# EAGLE design control-17 (EAGLE 9.0.1)
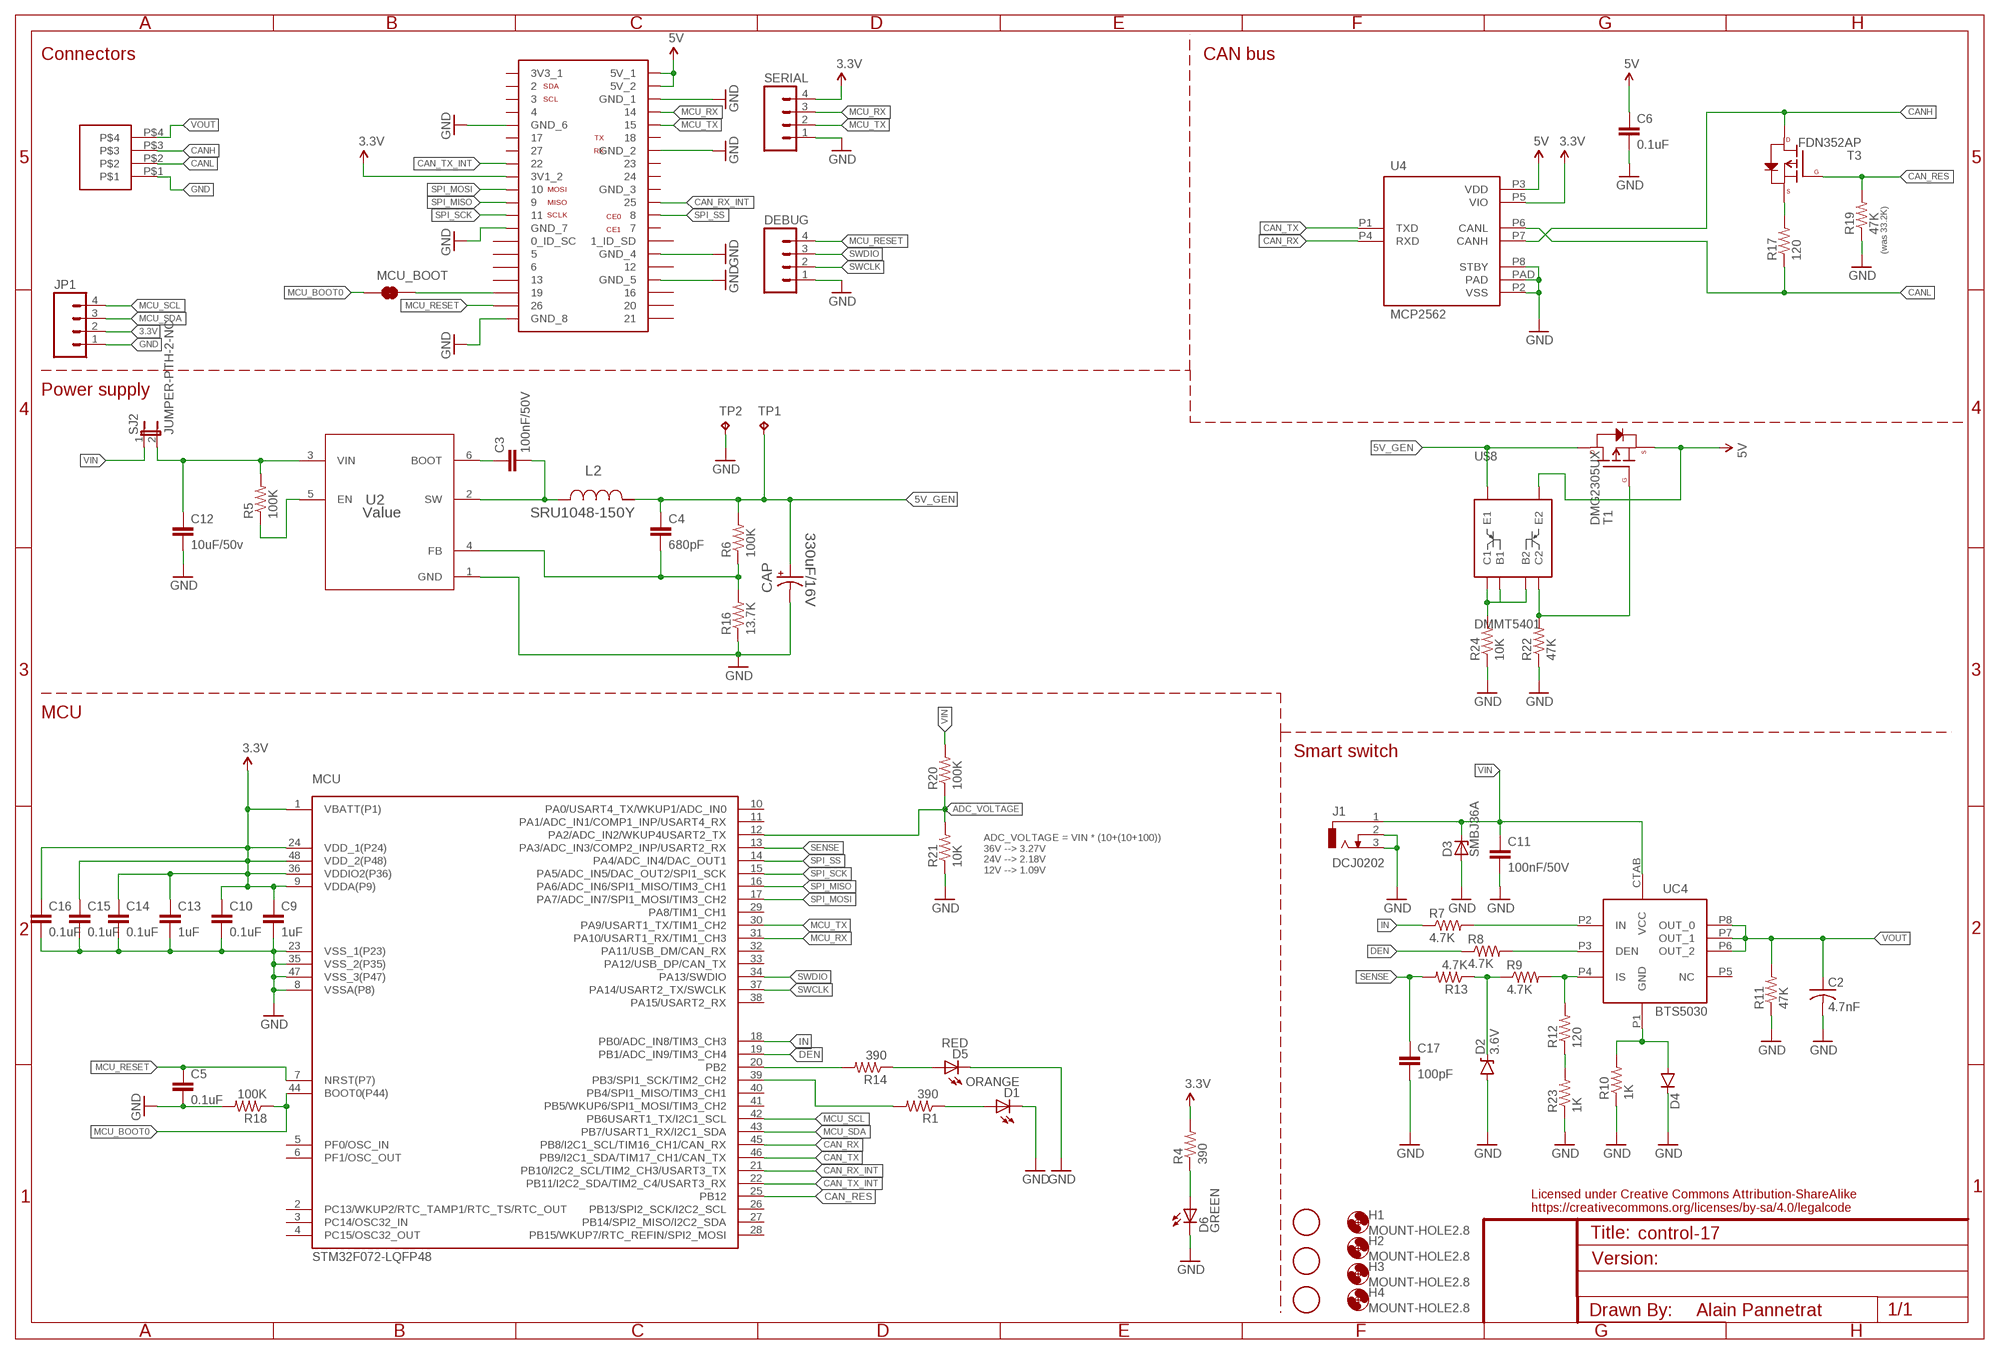
[diagram p0: schematic, sheet 1]

## Parts
C2  4.7nF  C-USC0805  [C0805]
C3  100nF/50V  CAP0805  [0805]
C4  680pF  CAP0603-CAP  [0603-CAP]
C5  0.1uF  CAP0603-CAP  [0603-CAP]
C6  0.1uF  CAP0603-CAP  [0603-CAP]
C9  1uF  CAP0805  [0805]
C10  0.1uF  CAP0603-CAP  [0603-CAP]
C11  100nF/50V  CAP0805  [0805]
C12  10uF/50v  CAP1206  [1206]
C13  1uF  CAP0805  [0805]
C14  0.1uF  CAP0603-CAP  [0603-CAP]
C15  0.1uF  CAP0603-CAP  [0603-CAP]
C16  0.1uF  CAP0603-CAP  [0603-CAP]
C17  100pF  CAP0805  [0805]
CAP  330uF/16V  CAP_POLE  [PANASONIC_E]
D1  ORANGE  LEDCHIPLED_0805  [CHIPLED_0805]
D2  3.6V  DIODE-ZENER3.3V  [SOD-323]
D3  SMBJ36A  ZENER-DIODESMB  [SMB]
D4  DIODESMA  [SMA-DIODE]
D5  RED  LEDCHIPLED_0805  [CHIPLED_0805]
D6  GREEN  LEDCHIPLED_0805  [CHIPLED_0805]
DEBUG  M04PTH  [1X04]
H1  MOUNT-HOLE2.8  [2,8]
H2  MOUNT-HOLE2.8  [2,8]
H3  MOUNT-HOLE2.8  [2,8]
H4  MOUNT-HOLE2.8  [2,8]
J1  DCJ0202  [DCJ0202]
JP1  M04JST  [1X04-1.5MM_JST]
L2  SRU1048-150Y  [SRU1048]
MCU  STM32F072-LQFP48  [LQFP48]
MCU_BOOT  JUMPER-PAD-2-NC_BY_TRACE  [PAD-JUMPER-2-NC_BY_TRACE_YES_SILK]
PI  RASPBERRY-PI-GPIO-SEPARATE  [2X20]
R1  390  R-US_R0603  [R0603]
R4  390  R-US_R0603  [R0603]
R5  100K  R-US_R0603  [R0603]
R6  100K  R-US_R0603  [R0603]
R7  4.7K  R-US_R0805  [R0805]
R8  4.7K  R-US_R0805  [R0805]
R9  4.7K  R-US_R0805  [R0805]
R10  1K  R-US_R0805  [R0805]
R11  47K  R-US_R0805  [R0805]
R12  120  R-US_R0805  [R0805]
R13  4.7K  R-US_R0805  [R0805]
R14  390  R-US_R0603  [R0603]
R16  13.7K  R-US_R0805  [R0805]
R17  120  R-US_R0805  [R0805]
R18  100K  R-US_R0603  [R0603]
R19  47K  R-US_R0805  [R0805]
R20  100K  R-US_R0603  [R0603]
R21  10K  R-US_R0805  [R0805]
R22  47K  R-US_R0805  [R0805]
R23  1K  R-US_R0805  [R0805]
R24  10K  R-US_R0805  [R0805]
SERIAL  M04PTH  [1X04]
SJ2  JUMPER-PTH-2-NC  [PTH-JUMPER-NC_BOTTOM_NO_SILK]
T1  DMG2305UX  P-CHANNEL-MOSFET  [SOT23-3]
T3  FDN352AP  P-CHANNEL-MOSFET  [SOT23-3]
TP1  TPPAD1-13  [P1-13]
TP2  TPPAD1-13  [P1-13]
U2  Value  TPS54202DDCR  [DDC0006A_N]
U4  MCP2562  [DFN3X3]
U$3  M04-PLUG-3.5  [M04-PLUG-3.5]
U$4  FIDUCIAL  [FIDUCIAL_1MM]
U$5  FIDUCIAL  [FIDUCIAL_1MM]
U$6  FIDUCIAL  [FIDUCIAL_1MM]
U$8  DMMT5401  [SOT-23-6]
UC4  BTS5030  [PG-DSO-8-43]

## Nets
3.3V: C9.1 C10.1 C13.1 C14.1 C15.1 C16.1 JP1.2 MCU.1(VBATT(P1)) MCU.9(VDDA(P9)) MCU.24(VDD_1(P24)) MCU.36(VDDIO2(P36)) MCU.48(VDD_2(P48)) PI.17(3V1_2) R4.2 SERIAL.4 U4.P5(VIO)
5V: C6.1 PI.2(5V_1) PI.4(5V_2) T1.2(S) U4.P3(VDD) U$8.5(E2)
5V_GEN: C4.1 CAP.+ L2.2 R6.2 T1.3(D) TP1.TP U$8.6(E1)
ADC_VOLTAGE: MCU.12(PA2/ADC_IN2/WKUP4USART2_TX) R20.1 R21.2
CAN_RES: MCU.25(PB12) R19.2 T3.1(G)
CAN_RX: MCU.45(PB8/I2C1_SCL/TIM16_CH1/CAN_RX) U4.P4(RXD)
CAN_RX_INT: MCU.21(PB10/I2C2_SCL/TIM2_CH3/USART3_TX) PI.22
CAN_TX: MCU.46(PB9/I2C1_SDA/TIM17_CH1/CAN_TX) U4.P1(TXD)
CAN_TX_INT: MCU.22(PB11/I2C2_SDA/TIM2_C4/USART3_RX) PI.15
CANH: T3.3(D) U4.P7(CANH) U$3.P$3
CANL: R17.1 U4.P6(CANL) U$3.P$2
DEN: MCU.19(PB1/ADC_IN9/TIM3_CH4) R8.1
GND: C2.2 C5.2 C6.2 C9.2 C10.2 C11.2 C12.2 C13.2 C14.2 C15.2 C16.2 C17.2 CAP.- D1.C D2.A D3.A D4.C D5.C D6.C DEBUG.1 J1.2 J1.3 JP1.1 MCU.8(VSSA(P8)) MCU.23(VSS_1(P23)) MCU.35(VSS_2(P35)) MCU.47(VSS_3(P47)) PI.6(GND_1) PI.9(GND_6) PI.14(GND_2) PI.25(GND_7) PI.30(GND_4) PI.34(GND_5) PI.39(GND_8) R10.1 R11.1 R16.1 R18.2 R19.1 R21.1 R22.1 R23.1 R24.1 SERIAL.1 TP2.TP U2.1(GND) U4.P2(VSS) U4.P8(STBY) U4.PAD U$3.P$1
IN: MCU.18(PB0/ADC_IN8/TIM3_CH3) R7.1
MCU_BOOT0: MCU.44(BOOT0(P44)) MCU_BOOT.1 R18.1
MCU_RESET: C5.1 DEBUG.4 MCU.7(NRST(P7)) PI.37
MCU_RX: MCU.31(PA10/USART1_RX/TIM1_CH3) PI.8 SERIAL.3
MCU_SCL: JP1.4 MCU.42(PB6USART1_TX/I2C1_SCL)
MCU_SDA: JP1.3 MCU.43(PB7/USART1_RX/I2C1_SDA)
MCU_TX: MCU.30(PA9/USART1_TX/TIM1_CH2) PI.10 SERIAL.2
N$1: D2.C R9.1 R13.1
N$2: D1.A R1.1
N$3: R7.2 UC4.P2(IN)
N$4: MCU_BOOT.2 PI.35
N$5: R5.1 U2.5(EN)
N$6: C12.1 R5.2 SJ2.2 U2.3(VIN)
N$7: C4.2 R6.1 R16.2 U2.4(FB)
N$8: R12.1 R23.2
N$10: R8.2 UC4.P3(DEN)
N$12: MCU.20(PB2) R14.2
N$13: R17.2 T3.2(S)
N$14: R9.2 R12.2 UC4.P4(IS)
N$15: D4.A R10.2 UC4.P1(GND)
N$16: MCU.39(PB3/SPI1_SCK/TIM2_CH2) R1.2
N$18: C3.2 L2.1 U2.2(SW)
N$19: D5.A R14.1
N$20: C3.1 U2.6(BOOT)
N$22: D6.A R4.1
N$26: R24.2 U$8.1(C1) U$8.2(B1) U$8.3(B2)
N$30: R22.2 T1.1(G) U$8.4(C2)
SENSE: C17.1 MCU.13(PA3/ADC_IN3/COMP2_INP/USART2_RX) R13.2
SPI_MISO: MCU.16(PA6/ADC_IN6/SPI1_MISO/TIM3_CH1) PI.21
SPI_MOSI: MCU.17(PA7/ADC_IN7/SPI1_MOSI/TIM3_CH2) PI.19
SPI_SCK: MCU.15(PA5/ADC_IN5/DAC_OUT2/SPI1_SCK) PI.23
SPI_SS: MCU.14(PA4/ADC_IN4/DAC_OUT1) PI.24
SWCLK: DEBUG.2 MCU.37(PA14/USART2_TX/SWCLK)
SWDIO: DEBUG.3 MCU.34(PA13/SWDIO)
VIN: C11.1 D3.C J1.1 R20.2 SJ2.1 UC4.CTAB(VCC)
VOUT: C2.1 R11.2 U$3.P$4 UC4.P6(OUT_2) UC4.P7(OUT_1) UC4.P8(OUT_0)
Unconnected: MCU.2(PC13/WKUP2/RTC_TAMP1/RTC_TS/RTC_OUT) MCU.3(PC14/OSC32_IN) MCU.4(PC15/OSC32_OUT) MCU.5(PF0/OSC_IN) MCU.6(PF1/OSC_OUT) MCU.10(PA0/USART4_TX/WKUP1/ADC_IN0) MCU.11(PA1/ADC_IN1/COMP1_INP/USART4_RX) MCU.26(PB13/SPI2_SCK/I2C2_SCL) MCU.27(PB14/SPI2_MISO/I2C2_SDA) MCU.28(PB15/WKUP7/RTC_REFIN/SPI2_MOSI) MCU.29(PA8/TIM1_CH1) MCU.32(PA11/USB_DM/CAN_RX) MCU.33(PA12/USB_DP/CAN_TX) MCU.38(PA15/USART2_RX) MCU.40(PB4/SPI1_MISO/TIM3_CH1) MCU.41(PB5/WKUP6/SPI1_MOSI/TIM3_CH2) PI.3 PI.5 PI.7 PI.11 PI.12 PI.13 PI.16 PI.18 PI.20(GND_3) PI.26 PI.27(0_ID_SC) PI.28(1_ID_SD) PI.29 PI.31 PI.32 PI.33 PI.36 PI.38 PI.40 UC4.P5(NC)

## Notes on the sheet
- Connectors | CAN bus
- (was 33.2K)
- Power supply
- MCU
- Smart switch
- ADC_VOLTAGE = VIN * (10+(10+100))
  36V --> 3.27V
  24V --> 2.18V
  12V --> 1.09V
- Licensed under Creative Commons Attribution-ShareAlike
  https://creativecommons.org/licenses/by-sa/4.0/legalcode
- Alain Pannetrat

## Power pins joined to a net without a drawn wire
3V3_1: PI.1(3V3_1)

## Library data of the parts
C2 = rcl:C-US: CAPACITOR, American symbol
C3 C5 C6 C9-C17 = SparkFun-Capacitors:CAP: Capacitor Standard 0603 ceramic capacitor, and 0.1" leaded capacitor.
C4 = SparkFun-Passives:CAP: Capacitor Standard 0603 ceramic capacitor, and 0.1" leaded capacitor.
CAP = SparkFun-Passives:CAP_POL: Capacitor Polarized These are standard SMD and PTH capacitors. Normally 10uF, 47uF, and 100uF in electrolytic and tantalum varieties. Always verify the external diameter of the through hole cap, it varies with capacity, voltage, and manufacturer. The EIA devices should be standard.
D1 D5 D6 = adafruit:LED: LED OSRAM: - CHIPLED LG R971, LG N971, LY N971, LG Q971, LY Q971, LO R971, LY R971 LH N974, LH R974 LS Q976, LO Q976, LY Q976 LO Q996 - Hyper CHIPLED LW Q18S LB Q993, LB Q99A, LB R99A - SideLED LS A670, LO A670, LY A670, LG A670, LP A670 LB A673, LV A673, LT A673, LW A673 LH A674 LY A675 LS A676, LA A676, LO A676, LY A676, LW A676 LS A679, LY A679, LG A679 - Hyper Micro SIDELED® LS Y876, LA Y876, LO Y876, LY Y876 LT Y87S - SmartLED LW L88C, LW L88S LB L89C, LB L89S, LG L890 LS L89K, LO L89K, LY L89K LS L896, LA L896, LO L896, LY L896 - TOPLED LS T670, LO T670, LY T670, LG T670, LP T670 LSG T670, LSP T670, LSY T670, LOP T670, LYG T670 LG T671, LOG T671, LSG T671 LB T673, LV T673, LT T673, LW T673 LH T674 LS T676, LA T676, LO T676, LY T676, LB T676, LH T676, LSB T676, LW T676 LB T67C, LV T67C, LT T67C, LS T67K, LO T67K, LY T67K, LW E67C LS E67B, LA E67B, LO E67B, LY E67B, LB E67C, LV E67C, LT E67C LW T67C LS T679, LY T679, LG T679 LS T770, LO T770, LY T770, LG T770, LP T770 LB T773, LV T773, LT T773, LW T773 LH T774 LS E675, LA E675, LY E675, LS T675 LS T776, LA T776, LO T776, LY T776, LB T776 LHGB T686 LT T68C, LB T68C - Hyper Mini TOPLED® LB M676 - Mini TOPLED Santana® LG M470 LS M47K, LO M47K, LY M47K Source: http://www.osram.convergy.de/
D2 = SparkFun-DiscreteSemi:DIODE-ZENER: Zener Diode Production Part - 8199 3.4V Zener Voltage; PROD_ID: DIO-11284; VALUE: 3.3V
D3 = diode:ZENER-DIODE: Z-Diode
D4 = SparkFun-DiscreteSemi:DIODE: Diode These are standard reverse protection diodes and small signal diodes. SMA package can handle up to about 1A. SOD-323 can handle about 200mA. What the SOD-323 package when ordering, there are some mfgs out there that are 5-pin packages.
DEBUG JP1 SERIAL = SparkFun-Connectors:M04: Header 4 Standard 4-pin 0.1" header. Use with straight break away headers (SKU : PRT-00116), right angle break away headers (PRT-00553), swiss pins (PRT-00743), machine pins (PRT-00117), and female headers (PRT-00115). Molex polarized connector foot print use with SKU : PRT-08231 with associated crimp pins and housings. 1MM SMD Version SKU: PRT-10208
H1-H4 = holes:MOUNT-HOLE: MOUNTING HOLE with drill center marker
J1 = con-jack:DCJ0202: DC POWER JACK Source: DCJ0202.pdf; OC_FARNELL: unknown; OC_NEWARK: unknown
L2 = AlainElements:SRU1048-150Y; DCR: 0.029; IDC: 3.2; L: 1.5E5; MANUFACTURER_NAME: Bourns; MANUFACTURER_PART_NUMBER: SRU1048150Y; VENDOR: Bourns
MCU = stm32f0:STM32F072
MCU_BOOT = SparkFun-Passives:JUMPER-PAD-2-NC_BY_TRACE
PI = pimoroni-headers:RASPBERRY-PI-GPIO-SEPARATE
R1 R4 R11 R14 R16 R18 R19 = adafruit:R-US_: RESISTOR, American symbol
R5-R10 R12 R13 R17 R20-R24 = resistor:R-US_: RESISTOR, American symbol
SJ2 = SparkFun-Passives:JUMPER-PTH-2-NC
T1 T3 = GeekAmmo:P-CHANNEL-MOSFET: P-Channel MOSFET Mode Field Effect Transistor
TP1 TP2 = testpad:TP: Test pad
U2 = AlainElements:TPS54202DDCR; ALTERNATEPARTNUMBER: TPS54202DDCT; APPLICATION_BUILDNUMBER: *; COMPTYPE: IC; MANUFACTURER: Texas Instruments; MANUFACTURER_NAME: Texas Instruments; MANUFACTURER_PART_NUMBER: TPS54202DDCR; MOUNTTYPE: SMT; PACKAGEREFERENCE: DDC0006A; PARTNUMBER: TPS54202DDCR; PIN_COUNT: 6; REFDES: RefDes; ROHS: Y; TYPE: TYPE
U4 = can:MCP2562
U$3 = AlainConnector:M04-PLUG-3.5
U$4-U$6 = adafruit:FIDUCIAL: For use by pick and place machines to calibrate the vision/machine, 1mm By microbuilder.eu
U$8 = pimoroni-ics:DMMT5401
UC4 = BTS5030:BTS5030

## Board
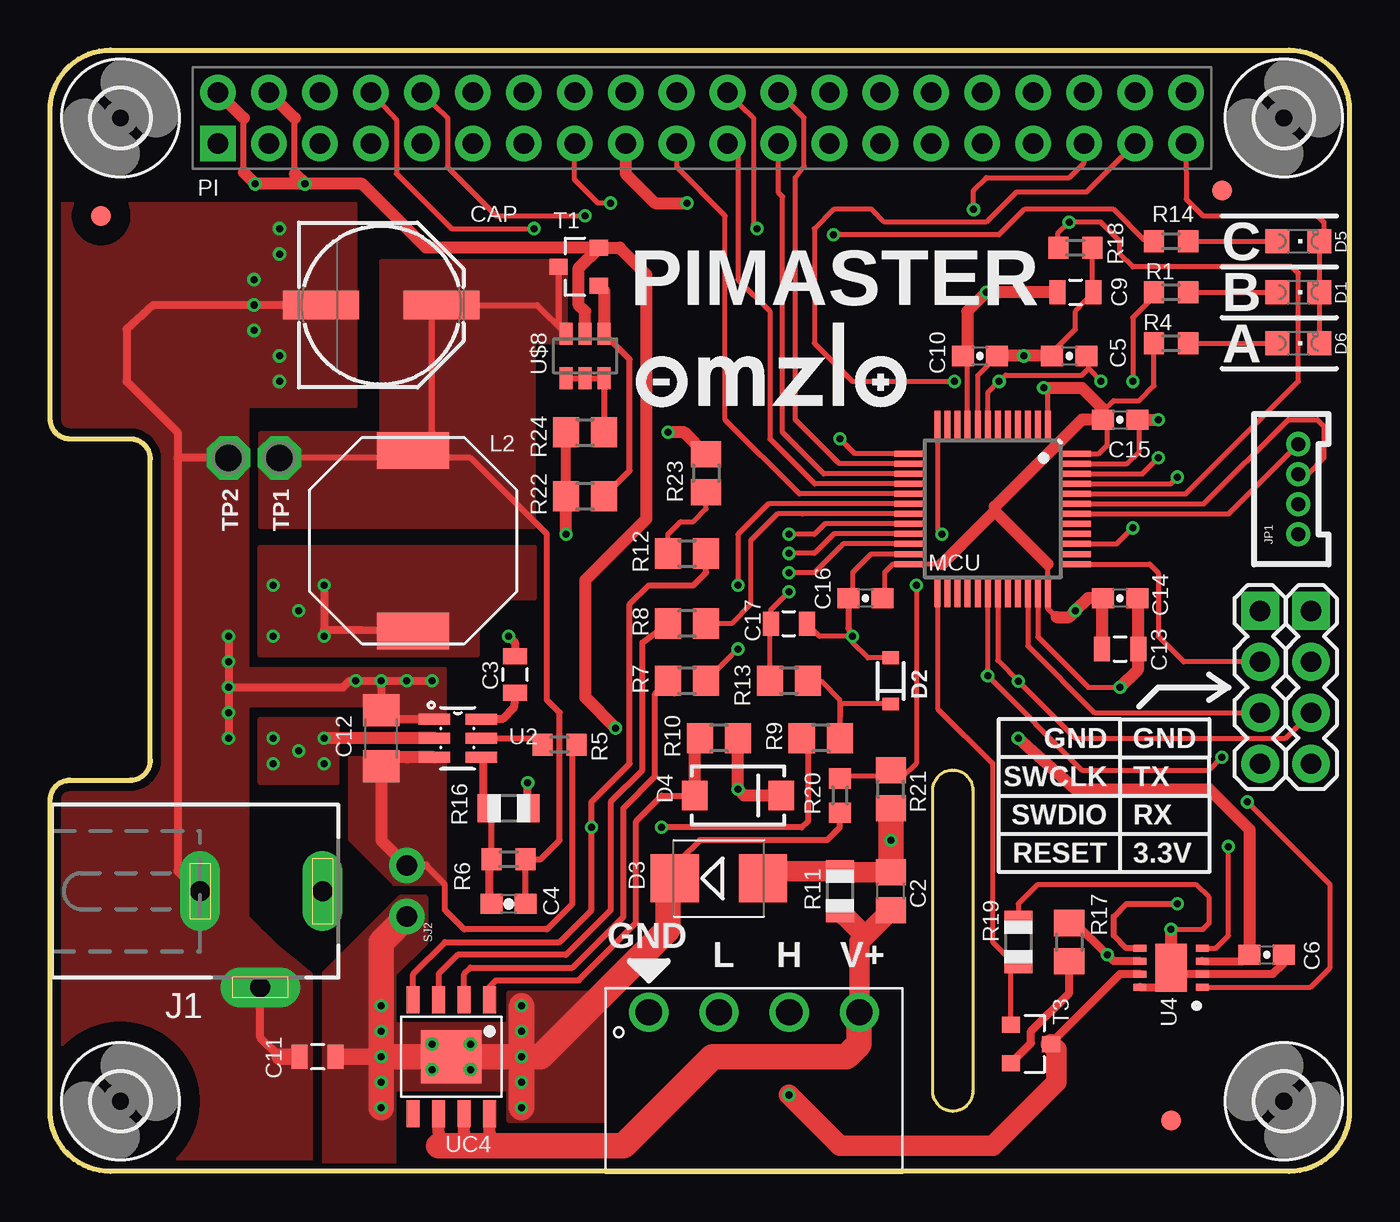
[diagram p1: board, top side]
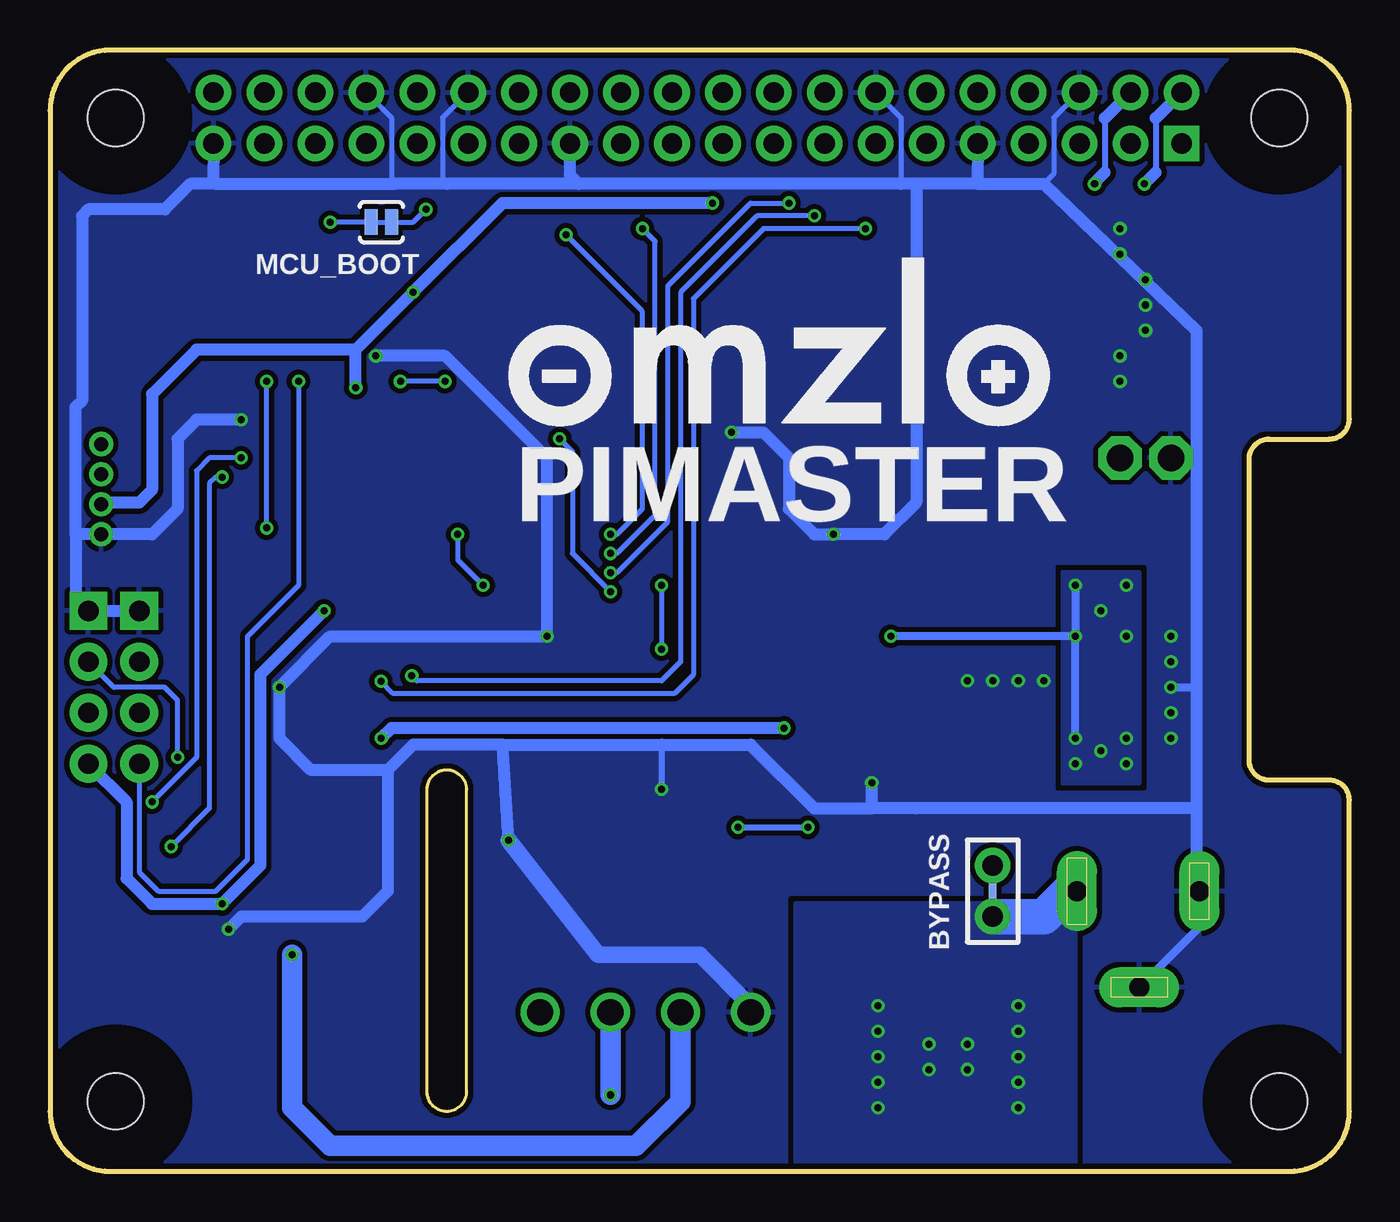
[diagram p2: board, bottom side, seen from below]

Size 64.77 x 55.88 mm. Coordinates in mm from the lower left corner, seen from the top.
Outline: 3,0 arc-90 0,3 0,18.5 arc-90 1,19.5 4,19.5 arc90 5,20.5 5,35.5 arc90 4,36.5 1,36.5 arc-90 0,37.5 0,52.88 arc-90 3,55.88 61.77,55.88 arc-90 64.77,52.88 64.77,3 arc-90 61.77,0 3,0
Outline: 44,4 44,19 arc-90 45,20 arc-90 46,19 46,4 arc-90 45,3 arc-90 44,4
Copper layers (1*16): Top 0.035mm / dielectric 1.5mm / Bottom 0.035mm
Design rules "SeeedStudio_2layer_DRU_no_angle_20140221": minimum track width 6mil, minimum drill 12mil, track to track 6mil, track to pad 6mil, pad to pad 6mil, via to via 6mil, smd to smd 0mil, copper to edge 10mil, drill to drill 10mil, minimum pad ring 10mil, minimum via ring 6mil, stop-mask expansion 2mil, vias tented up to drill 100mil, thermal gap 10mil

### Footprints (pad centres in the part's own frame; a part is rotated, then mirrored left to right if it is on the bottom)
C0805 = smd 1.3 x 1.5: 1 -0.95,0; 2 0.95,0
0805 = smd 0.8 x 1.2: 1 -0.9,0; 2 0.9,0
0603-CAP = smd 1.1 x 1: 1 -0.85,0; 2 0.85,0
1206 = smd 1.6 x 1.8: 1 -1.4,0; 2 1.4,0
PANASONIC_E = smd 3.8 x 1.4: + 3,0; - -3,0
CHIPLED_0805 = smd 1.2 x 1.2: A 0,-1.05; C 0,1.05
SOD-323 = smd 0.63 x 0.83: A 1.15,0; C -1.15,0
SMB = smd 2.4 x 2.4: A 2.2,0; C -2.2,0
SMA-DIODE = smd 1.27 x 1.47: A -2.15,0; C 2.15,0
1X04 = drill 1.016 pad 1.88 square: 1 0,0 | drill 1.016 pad 1.88: 2 2.54,0; 3 5.08,0; 4 7.62,0
2,8 = hole 2.8: 0,0
DCJ0202 = drill 1 pad 2 long: 1 0,3.1; 2 4.8,0; 3 0,-3
1X04-1.5MM_JST = drill 0.7: 1 0,0; 2 1.5,0; 3 3,0; 4 4.5,0
SRU1048 = smd 1.803 x 3.607: 1 -4.496,0; 2 4.496,0
LQFP48 = smd 1.5 x 0.3: 1 -4.15,2.75; 2 -4.15,2.25; 3 -4.15,1.75; 4 -4.15,1.25; 5 -4.15,0.75; 6 -4.15,0.25; 7 -4.15,-0.25; 8 -4.15,-0.75; 9 -4.15,-1.25; 10 -4.15,-1.75; 11 -4.15,-2.25; 12 -4.15,-2.75; 25 4.15,-2.75; 26 4.15,-2.25; 27 4.15,-1.75; 28 4.15,-1.25; 29 4.15,-0.75; 30 4.15,-0.25; 31 4.15,0.25; 32 4.15,0.75; 33 4.15,1.25; 34 4.15,1.75; 35 4.15,2.25; 36 4.15,2.75 | smd 0.3 x 1.5: 13 -2.75,-4.15; 14 -2.25,-4.15; 15 -1.75,-4.15; 16 -1.25,-4.15; 17 -0.75,-4.15; 18 -0.25,-4.15; 19 0.25,-4.15; 20 0.75,-4.15; 21 1.25,-4.15; 22 1.75,-4.15; 23 2.25,-4.15; 24 2.75,-4.15; 37 2.75,4.15; 38 2.25,4.15; 39 1.75,4.15; 40 1.25,4.15; 41 0.75,4.15; 42 0.25,4.15; 43 -0.25,4.15; 44 -0.75,4.15; 45 -1.25,4.15; 46 -1.75,4.15; 47 -2.25,4.15; 48 -2.75,4.15
PAD-JUMPER-2-NC_BY_TRACE_YES_SILK = smd 0.635 x 1.27: 1 -0.508,0; 2 0.508,0
2X20 = drill 1.016 pad 1.778 square: 1 -24.13,-1.27 | drill 1.016 pad 1.778: 2 -24.13,1.27; 3 -21.59,-1.27; 4 -21.59,1.27; 5 -19.05,-1.27; 6 -19.05,1.27; 7 -16.51,-1.27; 8 -16.51,1.27; 9 -13.97,-1.27; 10 -13.97,1.27; 11 -11.43,-1.27; 12 -11.43,1.27; 13 -8.89,-1.27; 14 -8.89,1.27; 15 -6.35,-1.27; 16 -6.35,1.27; 17 -3.81,-1.27; 18 -3.81,1.27; 19 -1.27,-1.27; 20 -1.27,1.27; 21 1.27,-1.27; 22 1.27,1.27; 23 3.81,-1.27; 24 3.81,1.27; 25 6.35,-1.27; 26 6.35,1.27; 27 8.89,-1.27; 28 8.89,1.27; 29 11.43,-1.27; 30 11.43,1.27; 31 13.97,-1.27; 32 13.97,1.27; 33 16.51,-1.27; 34 16.51,1.27; 35 19.05,-1.27; 36 19.05,1.27; 37 21.59,-1.27; 38 21.59,1.27; 39 24.13,-1.27; 40 24.13,1.27
R0603 = smd 1 x 1.1: 1 -0.85,0; 2 0.85,0
R0805 = smd 1.3 x 1.5: 1 -0.95,0; 2 0.95,0
R0805' = smd 1.1 x 1.4: 1 -1,0; 2 1,0
PTH-JUMPER-NC_BOTTOM_NO_SILK = drill 1.016 pad 1.778: 1 -1.27,0; 2 1.27,0 | smd 1.27 x 0.381 bottom: P$1 0,0
SOT23-3 = smd 0.8 x 0.9: 1 -0.95,-1; 2 0.95,-1; 3 0,1
P1-13 = drill 1.321 pad 2.159 octagon: TP 0,0
DDC0006A_N = smd 1.575 x 0.559: 1 -1.168,0.95; 2 -1.168,0; 3 -1.168,-0.95; 4 1.168,-0.95; 5 1.168,0; 6 1.168,0.95
DFN3X3 = smd 0.35 x 0.65: P1 -0.975,-1.55; P2 -0.325,-1.55; P3 0.325,-1.55; P4 0.975,-1.55; P5 0.975,1.55; P6 0.325,1.55; P7 -0.325,1.55; P8 -0.975,1.55 | smd 2.4 x 1.55: PAD 0,0
M04-PLUG-3.5 = drill 1.3: P$1 0,0; P$2 3.5,0; P$3 7,0; P$4 10.5,0
FIDUCIAL_1MM = smd 1 x 1: 1 0,0
SOT-23-6 = smd 0.65 x 1.1: 1 0.95,1.1; 2 0,1.1; 3 -0.95,1.1; 4 -0.95,-1.1; 5 0,-1.1; 6 0.95,-1.1
PG-DSO-8-43 = smd 2.65 x 3: CTAB 0,0 | smd 1.35 x 0.65: P1 -2.845,1.905; P2 -2.845,0.635; P3 -2.845,-0.635; P4 -2.845,-1.905; P5 2.845,-1.905; P6 2.845,-0.635; P7 2.845,0.635; P8 2.845,1.905

### Placement (x,y rotation side)
C2  41.91,13.97 90 top
C3  23.18,24.77 90 top
C4  22.86,13.34 180 top
C5  50.8,40.64 180 top
C6  60.64,10.79 0 top
C9  51.12,43.81 0 top
C10  46.35,40.64 0 top
C11  13.34,5.71 180 top
C12  16.51,21.59 90 top
C13  53.34,26.04 0 top
C14  53.34,28.57 0 top
C15  53.34,37.47 0 top
C16  40.64,28.57 180 top
C17  36.83,27.3 0 top
CAP  16.51,43.18 0 top
D1  62.23,43.81 270 top
D2  41.91,24.45 90 top
D3  33.34,14.61 0 top
D4  34.29,18.73 0 top
D5  62.23,46.35 270 top
D6  62.23,41.27 270 top
DEBUG  60.33,27.94 270 top
H1  3.5,3.5 0 top
H2  3.5,52.5 0 top
H3  61.5,3.5 90 top
H4  61.5,52.5 0 top
J1  10.48,13.97 270 top
JP1  62.23,31.75 90 top
L2  18.1,31.43 90 top
MCU  46.99,33.02 270 top
MCU_BOOT  48.26,47.31 0 bottom
PI  32.5,52.5 0 top
R1  55.88,43.81 180 top
R4  55.88,41.27 180 top
R5  25.4,21.27 0 top
R6  22.86,15.56 0 top
R7  31.75,24.45 180 top
R8  31.75,27.3 180 top
R9  38.42,21.59 180 top
R10  33.34,21.59 180 top
R11  47K  [R0805']  39.37,13.97 270 top
R12  31.75,30.8 0 top
R13  36.83,24.45 180 top
R14  55.88,46.35 180 top
R16  13.7K  [R0805']  22.86,18.1 180 top
R17  50.8,11.43 270 top
R18  51.12,46.04 0 top
R19  47K  [R0805']  48.26,11.43 270 top
R20  39.37,18.73 270 top
R21  41.91,19.05 90 top
R22  26.67,33.66 0 top
R23  32.7,34.8 270 top
R24  26.67,36.83 0 top
SERIAL  62.87,27.94 270 top
SJ2  17.78,13.97 90 top
T1  26.35,45.09 90 top
T3  48.9,6.35 270 top
TP1  11.43,35.56 90 top
TP2  8.89,35.56 0 top
U2  20.32,21.59 0 top
U4  55.88,10.16 90 top
U$1  [OMZLO-0.5]  29.21,38.1 0 top
U$2  [OMZLO]  41.91,37.15 0 bottom
U$3  29.84,7.94 0 top
U$4  58.42,48.9 0 top
U$5  2.54,47.62 0 top
U$6  55.88,2.54 0 top
U$8  26.67,40.64 180 top
UC4  20,5.71 270 top

### Tracks (layer width: path | path; a pad name or v marks a point on that pad's centre or on a via)
3.3V  (via drill 0.35)
  Top 0.254: C16.1 41.59,28.68 41.59,29.84 42.02,30.27 MCU.24 44.45,30.27 | 50.16,27.62 49.74,28.05 MCU.36 49.74,30.27 | MCU.9 45.74,40.41 45.61,40.53 | 45.61,40.53 C10.1 45.4,40.74 | MCU.48 52.28,35.77 52.7,36.2 52.7,37.25 C15.1 | 52.44,28.52 C14.1 | 45.72,40.64 45.61,40.53 | 52.49,37.88 53.02,38.42 54.29,38.42 55.03,39.16 R4.2 | MCU.1 49.74,38.84 v49.53,39.05
  Top 0.305: U4.P5 53.63,11.13 53.02,11.75 53.02,12.7 53.66,13.34 v56.2,13.34
  Top 0.61: C14.1 51.75,28.57 v51.12,27.94 50.8,27.62 50.16,27.62 | 52.44,28.52 C13.1 | C9.1 v46.67,43.81 45.72,42.86 45.72,40.64 | PI.17 28.69,49.73 30.16,48.26 v31.75,48.26 | 41.7,28.57 41.59,28.68 | 47.1,32.91 44.45,30.27 | 49.74,30.27 47.1,32.91 | v49.53,39.05 51.44,39.05 52.39,38.1 52.39,37.57 C15.1 | 52.49,37.88 C15.1 | C15.1 51.44,37.47 47.1,33.13 47.1,32.91
  Bottom 0.254: 62.14,33.34 JP1.2
  Bottom 0.61: SERIAL.4 60.96,18.41 60.96,14.61 59.69,13.34 v56.2,13.34 54.29,15.24 54.29,24.77 v51.12,27.94 | v31.75,48.26 42.23,48.26 v46.67,43.81 49.53,40.96 | 49.53,40.96 57.47,40.96 59.69,38.73 59.69,33.97 60.33,33.34 62.14,33.34 | v49.53,39.05 49.53,40.96
5V  (via drill 0.35)
  Top 0.254: 59.48,10.48 C6.1
  Top 0.305: 12.19,49.72 12.19,52.49 | 9.65,49.78 9.65,52.49
  Top 0.406: U4.P3 59.48,10.48
  Top 0.61: U$8.5 26.67,42.86 26.35,43.18 26.35,45.03 T1.2 | T1.2 18.73,46.03 15.56,49.21 v12.7,49.21 | 12.19,52.49 PI.4 | v12.7,49.21 12.19,49.72 | v12.7,49.21 v10.22,49.21 9.65,49.78 | 9.65,52.49 PI.2 | T1.2 28.39,46.03 29.72,44.7 29.72,32.51 26.67,29.46 26.67,23.62 v28.19,22.1 | v48.26,21.59 51.12,19.05 57.78,19.05 59.79,17.04 C6.1
  Bottom 0.305: 9.65,52.49 9.65,49.78 | 12.19,52.49 12.19,49.78 | 12.7,49.28 v12.7,49.21
  Bottom 0.61: v28.19,22.1 47.75,22.1 v48.26,21.59 | PI.2 9.65,52.49 | 9.65,49.78 v10.22,49.21 | PI.4 12.19,52.49 | 12.19,49.78 12.7,49.28
5V_GEN
  Top 0.305: 17.73,35.56 L2.2 19.05,36.88 19.05,43.18 | 17.73,35.56 TP1.TP | C4.1 R6.2 24.45,15.56 25.4,16.51 25.4,22.86 24.77,23.5 24.77,31.75 20.95,35.56 17.73,35.56 | CAP.+ 24.28,43.18 U$8.6 25.72,41.91 25.35,42.27 T1.3
  Top 0.406: C4.1 23.81,13.02 | 19.05,43.18 CAP.+
  Top 0.508: 23.81,13.34 C4.1
  pour Top (no thermals): 10.48,32.07 10.48,36.83 16.51,36.83 16.51,45.4 25.72,45.4 25.72,41.27 24.13,41.27 24.13,32.07
ADC_VOLTAGE  (via drill 0.35)
  Top 0.254: R20.1 39.37,19.68 41.59,19.68 R21.2 42.23,19.68 42.55,19.68 43.18,20.32 v43.18,29.21 | MCU.12 44.24,31.96 v44.45,31.75
  Bottom 0.254: v44.45,31.75 44.45,30.48 v43.18,29.21
CAN_RES
  Top 0.254: MCU.25 44.24,23.07 46.99,20.32 46.99,14.61 46.99,11.43 47.89,10.53 R19.2 47.9,10.16 T3.1
CAN_RX  (via drill 0.35)
  Top 0.254: MCU.45 55.86,34.27 v56.2,34.61 | U4.P4 58.12,11.13 58.74,11.75 v58.74,16.19
  Bottom 0.254: v56.2,34.61 56.52,34.61 56.83,34.29 56.83,18.1 v58.74,16.19
CAN_RX_INT  (via drill 0.35)
  Top 0.254: MCU.21 39.07,31.77 38.1,30.8 v36.83,30.8 | PI.22 35.05,52.51 35.05,47.18 v35.24,46.99
  Bottom 0.254: v36.83,30.8 36.51,30.8 34.61,32.7 34.61,46.35 v35.24,46.99
CAN_TX  (via drill 0.35)
  Top 0.254: MCU.46 54.45,34.77 v55.24,35.56 | v59.69,18.41 63.82,14.29 63.82,10.16 62.84,9.19 U4.P1
  Bottom 0.254: v55.24,35.56 56.83,35.56 57.47,34.92 57.47,20.64 v59.69,18.41
CAN_TX_INT  (via drill 0.35)
  Top 0.254: MCU.22 39.53,31.27 39.37,31.11 38.1,29.84 v36.83,29.84 | v27.94,48.26 27.69,48.26 27.3,48.26 26.15,49.41 PI.15
  Bottom 0.254: v36.83,29.84 36.51,29.84 33.97,32.38 33.97,44.13 29.84,48.26 v27.94,48.26
CANH  (via drill 0.35)
  Top 0.406: U4.P7 53.33,9.84 49.9,6.4 T3.3
  Top 0.61: 41.91,1.27 40.66,1.27
  Top 1.016: v36.83,3.81 39.37,1.27 41.91,1.27 46.99,1.27 49.53,3.81 49.9,4.17 50.16,4.45 50.16,6.08 T3.3
  Bottom 0.61: U$3.P$3 36.83,7.92
  Bottom 1.016: 36.83,7.92 v36.83,3.81
CANL  (via drill 0.35)
  Top 0.254: U4.P6
  Top 0.406: U4.P6 53.02,10.48 v52.7,10.79 51.12,12.38 R17.1
  Bottom 1.016: U$3.P$2 33.34,3.48 35.56,1.27 50.8,1.27 52.7,3.17 v52.7,10.79
DEN
  Top 0.254: MCU.19 37.53,32.77 36.26,32.77 34.92,31.43 34.92,28.26 33.97,27.3 R8.1
GND  (via drill 0.35)
  Top 0.254: 54.24,28.52 C14.2 | MCU.23 40.93,30.77 40.01,29.84 40.01,28.79 C16.2 | MCU.8 46.24,39.67 C10.2 | MCU.47 53.69,35.27 54.29,35.88 54.29,37.36 C15.2 | C5.2 49.95,40.8 51.12,41.96 51.12,42.86 C9.2 | 52.07,43.87 C9.2 | D2.A 40.76,25.6 40.01,26.35 v40.01,26.67 38.37,26.67 C17.2 | PI.39 56.64,48.45 57.47,47.62 63.18,47.62 63.5,47.31 63.5,46.58 D5.C D1.C D6.C | C9.2 52.07,43.81 51.97,43.92 R18.2 | C6.2 61.49,10.38 | U4.P2 | 56.2,9.84 U4.PAD 55.88,9.21 55.86,9.19 | MCU.35 49.24,26.64 51.75,24.13 v53.34,24.13 | v55.88,12.06 57.47,12.06 57.78,12.38 57.78,13.65 57.15,14.29 49.21,14.29 48.26,13.34 R19.1 | v25.72,31.75
  Top 0.305: C16.2 39.79,27.09 v40.01,26.67
  Top 0.406: v23.81,19.37 23.81,18.73 R16.1 | CAP.- 5.14,43.18 3.81,41.97 3.81,39.37 6.35,36.83 6.35,35.56 | 6.35,35.56 6.35,14.97 7.35,13.97 J1.3 | 61.49,10.38 60.96,9.84 U4.P2 | U4.P2 56.2,9.84 | U4.P8 55.86,9.19 | 11.43,5.71 10.48,6.67 J1.2 | v16.51,24.45 v15.24,24.45 14.92,24.45 14.61,24.13 v8.89,24.13 | v16.51,24.45 C12.2 16.96,22.54 U2.1 | v16.51,24.45 v17.78,24.45 v19.05,24.45 | TP2.TP 6.35,35.56 | v8.89,26.67 v8.89,25.4 v8.89,24.13 | v8.89,24.13 v8.89,22.86 v8.89,21.59
  Top 0.508: R22.1 R24.1
  Top 0.61: 54.24,28.52 C13.2 54.24,25.03 v53.34,24.13 | D4.C 34.61,18.73 v34.29,19.05 R10.1 | C5.2 v48.53,40.64 C10.2 | v55.88,12.06 U4.PAD | v25.72,31.75 R22.1 | R23.1 31.62,36.83 v30.8,36.83 | C15.2 v55.24,37.47
  Top 0.813: C11.2 11.43,5.71 | 39.42,14.92 R11.1 | 36.85,14.97 D3.A
  Top 1.016: C2.2 39.42,14.92 | R11.1 36.85,14.97
  Top 1.27: C2.2 v41.91,16.51 R21.1
  Bottom 0.254: PI.34 47.75,52.51 47.75,49.25 47.59,49.21 | PI.30 45.21,52.51 45.21,49.32 44.98,49.21 | 56.64,49.24 56.49,49.21 | PI.14 22.35,52.51 22.35,49.35 22.36,49.21 | PI.6 14.73,52.51 14.73,49.72 15.24,49.21 | 18.54,49.31 18.51,49.21
  Bottom 0.305: U$3.P$1 29.84,8.26 | 34.29,21.27 v34.29,19.05
  Bottom 0.406: v48.53,40.64 48.58,40.6 | J1.2 7.48,12.17 J1.3 | v8.89,24.13 7.62,24.13
  Bottom 0.61: v41.91,16.51 42.23,21.27 | 42.23,21.27 46.67,21.27 47.94,20 | 7.62,18.1 7.62,24.13 7.62,41.91 15.24,49.21 18.51,49.21 21.59,49.21 | 7.62,18.1 7.62,14.24 | 21.59,49.21 22.36,49.21 38.42,49.21 | 38.42,49.21 44.98,49.21 47.59,49.21 56.49,49.21 57.78,49.21 59.05,47.94 62.87,47.94 63.18,47.62 63.18,38.42 63.5,38.1 63.5,31.75 | 63.5,31.75 63.5,28.57 SERIAL.1 DEBUG.1 | 7.62,18.1 21.59,18.1 23.81,18.1 | 63.5,31.75 63.49,31.75 JP1.1 59.69,31.75 58.42,33.02 58.42,36.51 57.47,37.47 v55.24,37.47 | 38.42,49.21 38.86,49.66 PI.25 | PI.39 56.64,49.24 | PI.9 18.54,49.31 | 23.81,18.1 26.67,18.1 29.84,21.27 34.29,21.27 42.23,21.27 | 23.81,18.1 v23.81,19.37 | 47.94,20 51.75,20 53.34,21.59 v53.34,24.13 50.8,26.67 v40.01,26.67 40.01,35.56 45.09,40.64 v48.53,40.64 | 47.94,20 47.94,13.97 49.21,12.7 55.24,12.7 v55.88,12.06 | 21.59,49.21 21.59,33.34 23.18,31.75 v25.72,31.75 26.67,31.75 27.94,33.02 27.94,35.56 29.21,36.83 v30.8,36.83
  Bottom 0.813: 29.84,8.26 32.38,10.79 37.47,10.79 v41.91,16.51
  other vias: 11.43,46.99 11.43,45.72 10.16,44.45 10.16,43.18 10.16,41.91 11.43,40.64 11.43,39.37
  pour Top (isolate 0.406, rank 3, no thermals): 15.24,48.26 15.24,38.1 9.84,38.1 9.84,25.08 19.68,25.08 19.68,22.23 15.88,22.23 15.88,23.18 9.84,23.18 9.84,12.7 11.43,11.11 13.02,9.84 13.02,0 0,0 0,48.26
  pour Bottom (isolate 0.254, rank 3): 0,55.88 0,0 65.09,0 65.09,55.88
IN  (via drill 0.35)
  Top 0.254: MCU.18 35.81,33.27 34.29,31.75 v34.29,29.21 | v34.29,26.04 33.97,25.72 R7.1
  Bottom 0.254: v34.29,29.21 v34.29,26.04
MCU_BOOT0  (via drill 0.35)
  Top 0.254: MCU.44 56.63,33.77 62.23,39.37 62.23,44.77 61.91,45.09 53.98,45.09 53.34,45.72 53.34,46.35 52.39,47.31 v50.8,47.31 50.22,46.73 R18.1
  Bottom 0.254: MCU_BOOT.1 v50.8,47.31
MCU_RESET  (via drill 0.35)
  Top 0.254: MCU.7 46.74,38.8 v47.31,39.37 47.62,39.69 51.44,39.69 51.75,40.01 51.75,40.02 | C5.1 51.75,40.54 51.75,40.02 | 51.75,40.02 v52.39,39.38 | PI.37 51.67,48.81 48.17,48.81 46.67,47.31 41.59,47.31 40.96,47.94 39.05,47.94 38.1,46.99 38.1,41.27 40.01,39.37 v45.09,39.37
  Bottom 0.254: DEBUG.4 60.33,14.92 59.37,13.97 56.52,13.97 54.93,15.56 54.93,26.67 52.39,29.21 v52.39,39.38 | v45.09,39.37 v47.31,39.37
MCU_RX  (via drill 0.35)
  Top 0.254: SERIAL.3 61.59,21.59 51.12,21.59 v48.28,24.43 47.24,25.47 MCU.31 | PI.8 17.27,52.39 17.27,49.72 20,46.99 v24.13,46.99
  Bottom 0.254: v48.28,24.43 47.66,23.81 33.66,23.81 32.7,24.77 32.7,43.5 29.21,46.99 v24.13,46.99
MCU_SCL
  Top 0.254: MCU.42 58.75,32.77 JP1.4
MCU_SDA
  Top 0.254: MCU.43 57.53,33.27 61.72,37.47 63.18,37.47 63.5,37.15 63.5,35.56 62.69,34.75 JP1.3
MCU_TX  (via drill 0.35)
  Top 0.254: MCU.30 v46.74,24.7 51.44,20 57.78,20 v58.42,20.64 | PI.10 19.81,52.51 19.81,50.04 22.23,47.62 v26.67,47.62
  Bottom 0.254: v58.42,20.64 58.42,23.5 59.05,24.13 61.59,24.13 SERIAL.2 | v26.67,47.62 29.53,47.62 33.34,43.81 33.34,25.4 34.29,24.45 46.49,24.45 v46.74,24.7
N$1
  Top 0.254: R13.1 38.42,24.45 39.37,23.5 39.37,22 | 39.37,22 R9.1 | D2.C 39.4,23.3 39.37,22
N$2
  Top 0.254: R1.1 D1.A
N$3
  Top 0.305: 31.11,23.81 R7.2 30.16,23.81 30.16,19.68 28.57,18.1 28.57,12.7 26.04,10.16 20.95,10.16 20.64,9.84 UC4.P2
N$4  (via drill 0.35)
  Top 0.254: PI.35 51.55,50.28 50.8,49.53 46.67,49.53 46.04,48.9 v46.04,47.94
  Bottom 0.254: MCU_BOOT.2 46.67,47.31 v46.04,47.94
N$5
  Top 0.305: U2.5 24.45,21.59 24.55,21.49 R5.1
N$6
  Top 0.305: 18.73,15.24 19.68,14.29 19.68,13.02 20.64,12.06 24.77,12.06 26.04,13.34 26.04,21.06 R5.2
  Top 0.406: 18.73,15.24 SJ2.2
  Top 0.61: U2.3 17.78,20.64 16.51,20.64 16.51,16.51 SJ2.2
  pour Top (no thermals): 14.92,20.64 19.68,20.64 19.68,14.29 17.14,14.29 14.92,16.51
N$7
  Top 0.305: R6.1 22.01,17.95 R16.2
  Top 0.406: U2.4 21.59,20.64 21.59,20 21.59,18.41 R16.2 | 22.23,13.34 C4.2 21.91,13.34 21.91,15.56 R6.1
  Top 0.61: 21.86,15.61 21.91,15.56
N$8
  Top 0.254: R12.1 30.8,31.75 31.43,32.38 32.07,32.38 32.7,33.02 R23.2 32.7,33.97
N$10
  Top 0.305: R8.2 29.53,26.35 29.53,20 27.94,18.41 27.94,13.02 25.72,10.79 20.32,10.79 19.37,9.84 UC4.P3
N$12  (via drill 0.35)
  Top 0.254: MCU.20 38.62,32.27 38.1,31.75 v36.83,31.75 | v39.05,46.67 47.31,46.67 48.58,47.94 53.02,47.94 54.56,46.41 54.93,46.41 R14.2
  Bottom 0.254: v36.83,31.75 36.51,31.75 35.24,33.02 35.24,42.86 v39.05,46.67
N$13
  Top 0.406: T3.2 48.9,6.4 48.9,6.99 50.8,8.89 R17.2
N$14  (via drill 0.35)
  Top 0.254: R9.2
  Top 0.305: R12.2 32.7,29.84 32.07,29.21 29.84,29.21 28.89,28.26 28.89,20.32 26.99,18.41 v26.99,17.14 26.99,13.02 25.4,11.43 19.68,11.43 18.1,9.84 UC4.P4 | R9.2 37.47,21.27 37.78,20.95 37.78,17.46 37.47,17.14 v30.48,17.14
  Bottom 0.305: v30.48,17.14 v26.99,17.14
N$15
  Top 0.305: UC4.P1 21.91,9.21 22.23,9.53 26.35,9.53 29.21,12.38 29.21,17.46 30.48,18.73 D4.A
  Top 0.61: D4.A 32.14,21.34 32.7,21.91 R10.2
N$16  (via drill 0.35)
  Top 0.254: R1.2 55.24,43.81 53.98,42.55 v53.98,39.37 | MCU.39 53.18,31.27 v53.98,32.07
  Bottom 0.254: v53.98,32.07 v53.98,39.37
N$18  (via drill 0.35)
  Top 0.406: v13.65,29.21 13.65,26.99 15.51,26.99 L2.1 | 22.86,26.62 v22.86,26.67 23.18,26.35 23.18,25.72 23.12,25.66 C3.2
  Top 0.61: U2.2 v13.65,21.59
  Bottom 0.406: v13.65,21.59 v13.65,26.67 | v13.65,29.21 v13.65,26.67 | v13.65,26.67 v22.86,26.67
  other vias: 11.11,29.21 12.38,27.94 11.11,26.67 13.65,20.32 11.11,20.32 11.11,21.59 12.38,20.95
  pour Top: 14.29,22.54 14.29,19.37 10.48,19.37 10.48,22.54
  pour Bottom (no thermals): 14.29,29.84 14.29,19.37 10.48,19.37 10.48,29.84
  pour Top (no thermals): 10.48,31.11 24.13,31.11 24.13,28.57 22.86,28.57 21.27,26.99 21.27,25.72 10.48,25.72
N$19
  Top 0.254: R14.1 D5.A
N$20
  Top 0.406: C3.1 23.12,23.12 22.54,22.54 U2.6
N$22
  Top 0.254: R4.1 D6.A
N$26
  Top 0.305: 27.62,39.47 R24.2 | 27.62,39.47 U$8.3 | U$8.1 U$8.2 27.55,39.54 27.62,39.47
N$30
  Top 0.305: R22.2 28.89,34.92 28.89,40.47 U$8.4 | T1.1 27.62,43.87
  Top 0.61: 27.62,43.87 U$8.4
SENSE  (via drill 0.35)
  Top 0.254: MCU.13 40.11,35.77 v39.37,36.51 | R13.2 35.88,27.25 C17.1 35.93,27.99 v36.83,28.89
  Bottom 0.254: v39.37,36.51 38.73,35.88 38.73,30.8 v36.83,28.89
SPI_MISO
  Top 0.254: MCU.16 38.12,34.27 35.88,36.51 35.88,42.86 34.29,44.45 34.29,50.8 33.86,51.23 PI.21
SPI_MOSI
  Top 0.254: MCU.17 37.35,33.77 33.66,37.47 33.66,47.62 31.24,50.04 PI.19
SPI_SCK
  Top 0.254: MCU.15 38.57,34.77 36.51,36.83 36.51,48.58 36.32,48.77 PI.23
SPI_SS
  Top 0.254: MCU.14 39.34,35.27 37.15,37.47 37.15,49.53 37.59,50.1 37.59,52.51 PI.24
SWCLK
  Top 0.254: DEBUG.2 56.52,25.4 55.34,26.57 | 55.34,26.57 55.24,26.67 | MCU.37 54.82,30.27 55.24,29.84 55.24,26.67 | 55.24,26.67 55.34,26.57
SWDIO
  Top 0.254: MCU.34 48.74,26.19 52.07,22.86 DEBUG.3
VIN  (via drill 0.35)
  Top 0.305: R20.2 39.37,17.14 38.73,16.51 32.38,16.51 31.43,15.56 31.11,14.9 D3.C
  Top 0.813: v16.51,5.71 C11.1
  Top 1.27: v16.51,5.71 UC4.CTAB v23.5,5.71 | v23.5,5.71 24.45,5.71 30.8,12.06 30.8,13.63 D3.C | v23.5,8.26 v23.5,6.99 v23.5,5.71 | v23.5,5.71 v23.5,4.45 v23.5,3.17 | v16.51,5.71 v16.51,6.99 v16.51,8.26 16.51,11.43 SJ2.1 | v16.51,5.71 v16.51,4.45 v16.51,3.17
  Bottom 0.406: J1.1 13.97,13.97
  Bottom 1.778: SJ2.1 15.24,12.7 13.97,13.97
  other vias: 19.05,6.35 20.95,6.35 20.95,5.08 19.05,5.08
  pour Top (no thermals): 13.65,9.84 13.65,0 17.46,0 17.14,0.32 17.14,4.13 22.86,4.13 22.86,2.54 27.62,2.54 27.62,8.89 22.86,8.89 22.86,7.3 17.14,7.3 17.14,9.84 18.73,11.43 18.73,13.65 17.46,13.65
  pour Bottom (no thermals): 13.65,0 13.65,13.34 27.62,13.34 27.62,0
VOUT
  Top 0.305: 21.91,1.91 21.91,1.27 | 20.64,1.27 20.64,1.91 | 19.37,1.27 19.37,1.91
  Top 0.61: 40.32,7.92 U$3.P$4 | 21.91,1.91 UC4.P8 | 20.64,1.91 UC4.P7 | 19.37,1.91 UC4.P6
  Top 1.016: 40.64,11.75 C2.1 | 40.64,11.75 R11.2 | U$3.P$4 40.34,11.46 40.64,11.75
  Top 1.27: 40.32,7.92 40.32,6.35 39.69,5.71 33.02,5.71 28.57,1.27 21.91,1.27 20.64,1.27 19.37,1.27

### Text on the board
tPlace: L | H | V+
bPlace: BYPASS
tOrigins: I2C
tNames: C | PIMASTER | B | A | GND | GND | SWCLK | TX | SWDIO | RX | RESET | 3.3V | GND
bNames: PIMASTER